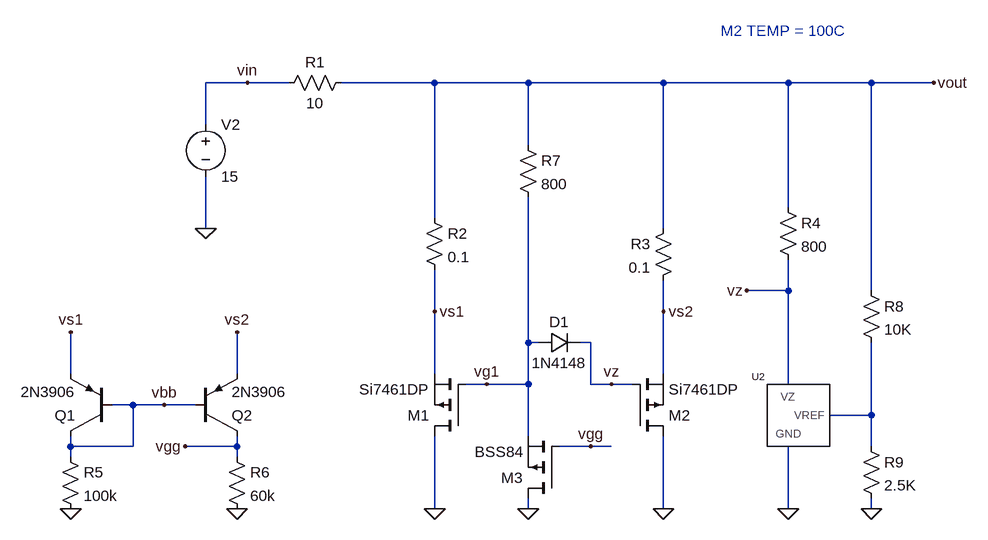
[diagram p0: schematic foo-temp.asc]
foo-temp.asc, the LTspice schematic file:
Version 4
SHEET 1 3156 2404
WIRE 96 32 32 32
WIRE 160 32 96 32
WIRE 384 32 240 32
WIRE 528 32 384 32
WIRE 736 32 528 32
WIRE 928 32 736 32
WIRE 1056 32 928 32
WIRE 1152 32 1056 32
WIRE 32 96 32 32
WIRE 528 128 528 32
WIRE 928 224 928 32
WIRE 384 240 384 32
WIRE 32 256 32 176
WIRE 736 256 736 32
WIRE 928 352 928 304
WIRE 928 352 864 352
WIRE 1056 352 1056 32
WIRE 384 384 384 320
WIRE 736 384 736 336
WIRE 528 432 528 208
WIRE 544 432 528 432
WIRE 624 432 608 432
WIRE -176 480 -176 416
WIRE 80 480 80 416
WIRE 384 480 384 384
WIRE 736 480 736 384
WIRE 464 496 432 496
WIRE 528 496 528 432
WIRE 528 496 464 496
WIRE 624 496 624 432
WIRE 656 496 624 496
WIRE 688 496 656 496
WIRE 928 496 928 352
WIRE -80 528 -112 528
WIRE -32 528 -80 528
WIRE 16 528 -32 528
WIRE 1056 544 1056 432
WIRE 1056 544 992 544
WIRE 528 576 528 496
WIRE -176 592 -176 576
WIRE -80 592 -80 528
WIRE -80 592 -176 592
WIRE 80 592 80 576
WIRE 80 592 0 592
WIRE 624 592 576 592
WIRE 656 592 624 592
WIRE 1056 592 1056 544
WIRE -176 608 -176 592
WIRE 80 608 80 592
WIRE 384 688 384 576
WIRE 528 688 528 672
WIRE 736 688 736 576
WIRE 928 688 928 592
WIRE 1056 688 1056 672
FLAG 96 32 vin
FLAG 1056 688 0
FLAG 1152 32 vout
FLAG 928 688 0
FLAG 384 688 0
FLAG 32 256 0
FLAG 384 384 vs1
FLAG 736 384 vs2
FLAG 864 352 vz
FLAG -176 688 0
FLAG 80 688 0
FLAG 624 592 vgg
FLAG 0 592 vgg
FLAG -176 416 vs1
FLAG 80 416 vs2
FLAG 528 688 0
FLAG 736 688 0
FLAG 464 496 vg1
FLAG -32 528 vbb
FLAG 656 496 vz
SYMBOL res 144 48 R270
WINDOW 0 32 56 VTop 2
WINDOW 3 0 56 VBottom 2
SYMATTR InstName R1
SYMATTR Value 10
SYMBOL res 1040 336 R0
SYMATTR InstName R8
SYMATTR Value 10K
SYMBOL res 1040 576 R0
SYMATTR InstName R9
SYMATTR Value 2.5K
SYMBOL zht431 928 560 M0
SYMATTR InstName U2
SYMBOL pmos 432 576 R180
SYMATTR InstName M1
SYMATTR Value Si7461DP
SYMBOL pmos 688 576 M180
SYMATTR InstName M2
SYMATTR Value Si7461DP
SYMATTR Value2 TEMP=130
SYMBOL res 368 224 R0
SYMATTR InstName R2
SYMATTR Value 0.1
SYMBOL res 752 240 M0
SYMATTR InstName R3
SYMATTR Value 0.1
SYMBOL voltage 32 80 R0
WINDOW 123 0 0 Left 0
WINDOW 39 0 0 Left 0
SYMATTR InstName V2
SYMATTR Value 15
SYMBOL res 912 208 R0
SYMATTR InstName R4
SYMATTR Value 800
SYMBOL pnp -112 576 R180
SYMATTR InstName Q1
SYMATTR Value 2N3906
SYMBOL pnp 16 576 M180
SYMATTR InstName Q2
SYMATTR Value 2N3906
SYMBOL pmos 576 672 R180
SYMATTR InstName M3
SYMATTR Value BSS84
SYMBOL res -192 592 R0
SYMATTR InstName R5
SYMATTR Value 100k
SYMBOL res 64 592 R0
SYMATTR InstName R6
SYMATTR Value 60k
SYMBOL res 512 112 R0
SYMATTR InstName R7
SYMATTR Value 800
SYMBOL diode 544 448 R270
WINDOW 0 32 32 VTop 2
WINDOW 3 0 32 VBottom 2
SYMATTR InstName D1
SYMATTR Value 1N4148
TEXT 824 -48 Left 2 ;M2 TEMP = 100C

The netlist it stands for:
* foo-temp.asc
R1 vin vout 10
R8 vout N001 10K
R9 N001 0 2.5K
XU2 vz N001 0 ZHT431  ; pins VZ VREF GND
M1 0 vg1 vs1 vs1 Si7461DP
M2 0 vz vs2 vs2 Si7461DP TEMP=130
R2 vout vs1 0.1
R3 vout vs2 0.1
V2 vin 0 15
R4 vout vz 800
Q1 vbb vbb vs1 0 2N3906
Q2 vgg vbb vs2 0 2N3906
M3 0 vgg vg1 vg1 BSS84
R5 vbb 0 100k
R6 vgg 0 60k
R7 vout vg1 800
D1 vg1 vz 1N4148
.model D D
.lib standard.dio
.model NPN NPN
.model PNP PNP
.lib standard.bjt
.model NMOS NMOS
.model PMOS PMOS
.lib standard.mos
* M2 TEMP = 100C
.backanno
.end